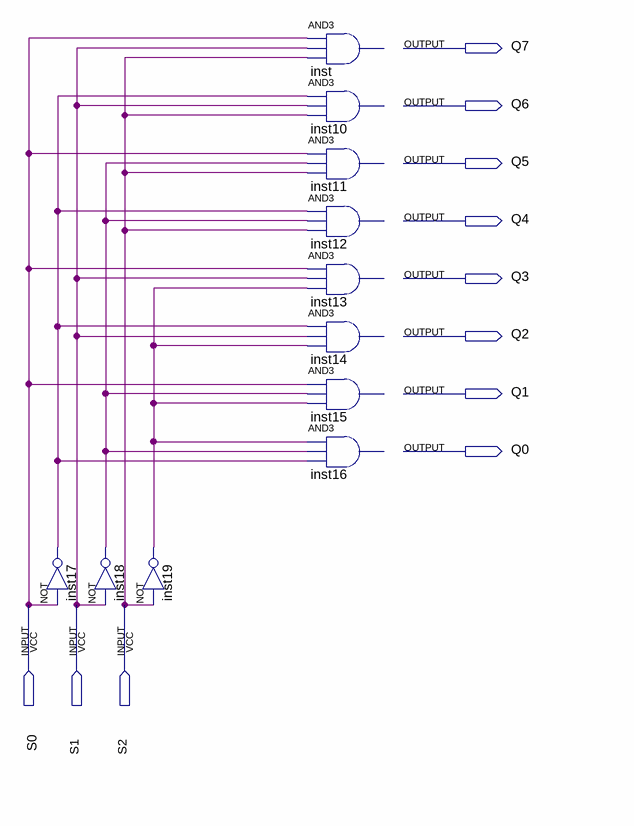
[diagram p0: schematic sheet]
// Quartus schematic 3to1Decoder.bdf as structural Verilog: 11 symbols, 11 pins
module \3to1Decoder  (
  input  S0,
  input  S1,
  input  S2,
  output Q7,
  output Q6,
  output Q5,
  output Q4,
  output Q3,
  output Q2,
  output Q1,
  output Q0
);

  wire inst17_out, inst18_out, inst19_out;

  not inst17 (inst17_out, S0);
  not inst18 (inst18_out, S1);
  not inst19 (inst19_out, S2);
  // AND3 inst has open pins: IN1=S0, IN2=S1, IN3=S2, OUT=open
  // AND3 inst10 has open pins: IN1=inst17_out, IN2=S1, IN3=S2, OUT=open
  // AND3 inst11 has open pins: IN1=S0, IN2=inst18_out, IN3=S2, OUT=open
  // AND3 inst12 has open pins: IN1=inst17_out, IN2=inst18_out, IN3=S2, OUT=open
  // AND3 inst13 has open pins: IN1=S0, IN2=S1, IN3=inst19_out, OUT=open
  // AND3 inst14 has open pins: IN1=inst17_out, IN2=S1, IN3=inst19_out, OUT=open
  // AND3 inst15 has open pins: IN1=S0, IN2=inst18_out, IN3=inst19_out, OUT=open
  // AND3 inst16 has open pins: IN1=inst19_out, IN2=inst18_out, IN3=inst17_out, OUT=open
endmodule
